# Altium schematic sheet Port.SchDoc
size A4; SheetNumber: 3; SheetTotal: 7
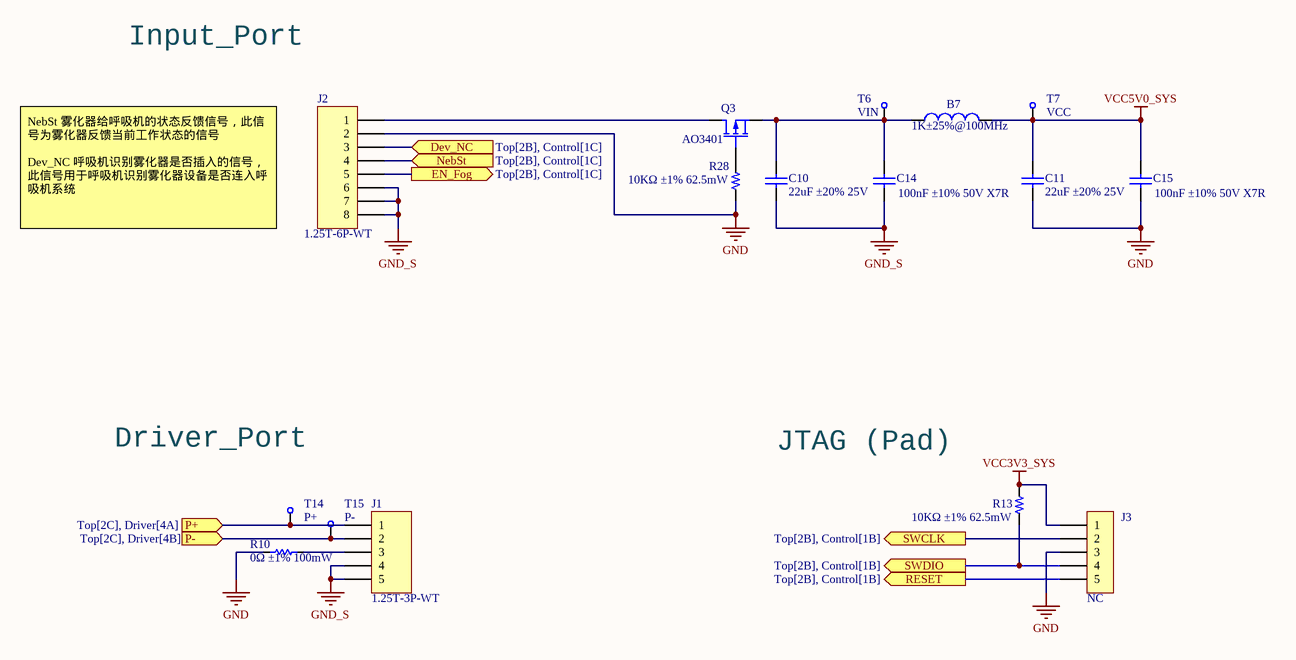
[diagram p0: Port.SchDoc]

## Parts
B7  1K±25%@100MHz  [0805-B]
C10  22uF ±20% 25V  [C0805]
C11  22uF ±20% 25V  [C0805]
C14  100nF ±10% 50V X7R  [C0402]
C15  100nF ±10% 50V X7R  [C0402]
J1  1.25T-3P-WT  [WAFER_1.25MMX3P_180]
J2  1.25T-6P-WT  [WAFER_1.25MMX6P_180]
J3  NC  [JST_PH 2.00-5]
Q3  AO3401  [SOT23]
R10  0Ω ±1% 100mW  [R0603]
R13  10KΩ ±1% 62.5mW  [R0402]
R28  10KΩ ±1% 62.5mW  [R0402]
T6  VIN  [TP-SIP-1-Small1]
T7  VCC  [TP-SIP-1-Small1]
T14  P+  [TP-SIP-1-Small1]
T15  P-  [TP-SIP-1-Small1]

## Ports
Dev_NC (in, see Top[2B], Control[1C]), EN_Fog (out, see Top[2B], Control[1C]), NebSt (in, see Top[2B], Control[1C]), P+ (in, see Top[2C], Driver[4A]), P- (in, see Top[2C], Driver[4B]), RESET (out, see Top[2B], Control[1B]), SWCLK (out, see Top[2B], Control[1B]), SWDIO (out, see Top[2B], Control[1B])

## Nets
GND: C11.1 C15.1 J2.2 J3.3 R10.1 R28.1
GND_S: C10.1 C14.1 J1.4 J1.5 J2.6 J2.7 J2.8
VCC3V3_SYS: J3.1 R13.2
VCC5V0_SYS: B7.2 C11.2 C15.2 T7.1
Dev_NC: J2.3 ; port Dev_NC
EN_Fog: J2.5 ; port EN_Fog
NebSt: J2.4 ; port NebSt
P+: J1.1 T14.1 ; port P+
P-: J1.2 T15.1 ; port P-
RESET: J3.5 ; port RESET
SWCLK: J3.2 ; port SWCLK
SWDIO: J3.4 R13.1 ; port SWDIO
NetB7_1: B7.1 C10.2 C14.2 Q3.3(S) T6.1
NetJ1_3: J1.3 R10.2
NetJ2_1: J2.1 Q3.2(D)
NetQ3_1: Q3.1(G) R28.2

## Notes on the sheet
- Input_Port
- NebSt 雾化器给呼吸机的状态反馈信号，此信号为雾化器反馈当前工作状态的信号
  Dev_NC 呼吸机识别雾化器是否插入的信号，此信号用于呼吸机识别雾化器设备是否连入呼吸机系统
- Driver_Port
- JTAG (Pad)

## Library data of the parts
B7 = Inductor: BLM21AG102SN1D; Code_IEC: 1005; Value: 10uH; Published: 8-Jun-2000; LatestRevisionDate: 29-May-2009; LatestRevisionNote: IPC-7351 Footprint Added.; PackageReference: 0402-A; Publisher: Altium Limited; PackageDescription: Chip Inductor; Code_JEITA: 0402
C10 C11 = C0805: CL21A226MAQNNNE; Published: 8-Jun-2000; LatestRevisionDate: 17-Jul-2002; LatestRevisionNote: Re-released for DXP Platform.; PackageReference: RAD-0.3; Publisher: Altium Limited; PackageDescription: Radial Cap, Thru-Hole; 2 Leads; 0.3 in Pin Spacing
C14 C15 = Cap: CL05B104KO5NNNC; Published: 8-Jun-2000; LatestRevisionDate: 17-Jul-2002; LatestRevisionNote: Re-released for DXP Platform.; PackageReference: RAD-0.3; Publisher: Altium Limited; PackageDescription: Radial Cap, Thru-Hole; 2 Leads; 0.3 in Pin Spacing
J1 = Header 5: LatestRevisionDate: 17-Jul-2002; LatestRevisionNote: Re-released for DXP Platform.; Publisher: Altium Limited
J2 = Header 8: LatestRevisionDate: 17-Jul-2002; LatestRevisionNote: Re-released for DXP Platform.; Publisher: Altium Limited
J3 = JST_PH 2.00-5: 品牌：JST 型号：B5B-PH-K-S，直插，间距2.00，5pin; 名称: 插座2针，2.0间距; 制造商: JST; 物料编号: B5B-PH-K-S
Q3 = MOSFET-P: Published: 8-Jun-2000; LatestRevisionDate: 17-Jul-2002; LatestRevisionNote: Re-released for DXP Platform.; PackageVersion: 1995/1996; PackageReference: E3; Publisher: Altium Limited; PackageDescription: TO, Flat Index; 3 In-Line, Axial Leads; Body Dia. 4.6mm; Lead Dia. 0.5 mm (max)
R10 = R0603: 0603WAF0000T5E; Published: 8-Jun-2000; LatestRevisionDate: 17-Jul-2002; LatestRevisionNote: Re-released for DXP Platform.; PackageReference: AXIAL-0.3; Publisher: Altium Limited; PackageDescription: Axial Device, Thru-Hole; 2 Leads; 0.3 in Pin Spacing
R13 R28 = R-0603: 0402WGF1002TCE
T6 T7 T14 T15 = TP-SIP-1-Small